# Altium schematic sheet Bawah.SchDoc
size A
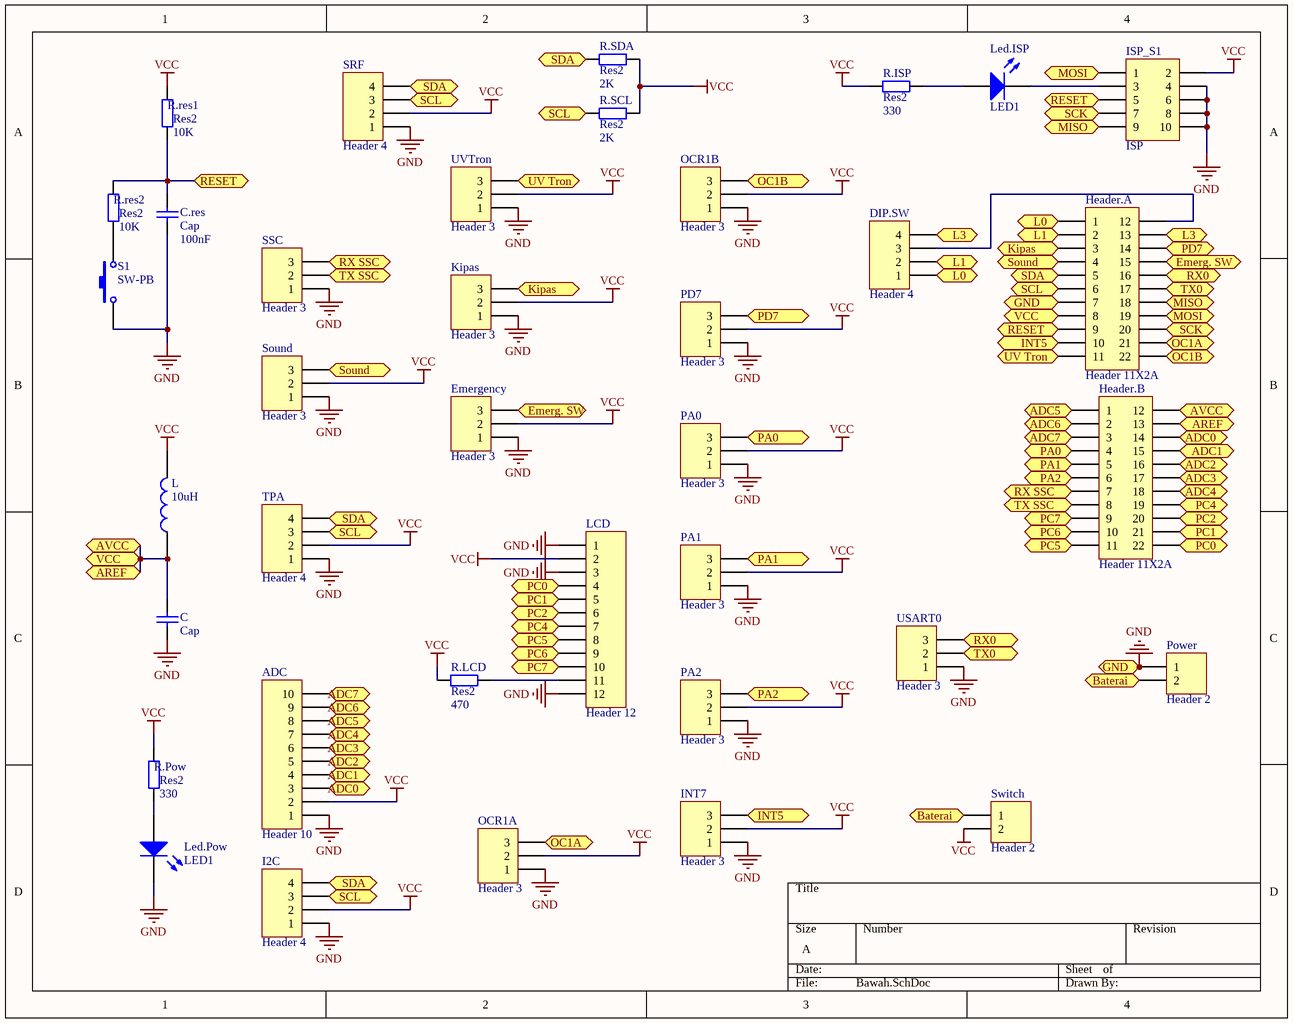
[diagram p0: Bawah.SchDoc]

## Parts
ADC  Header 10  [HDR1X10]
C  Cap  [RAD-0.3]
C.res  Cap  value 100nF  [RAD-0.3]
DIP.SW  Header 4  [HDR1X4]
Emergency  Header 3  [HDR1X3]
Header.A  Header 11X2A  [HDR2X11_CEN]
Header.B  Header 11X2A  [HDR2X11_CEN]
I2C  Header 4  [HDR1X4]
INT7  Header 3  [HDR1X3]
ISP_S1  ISP  [HDR2X5]
Kipas  Header 3  [HDR1X3]
L  10uH  [AXIAL-0.3]
LCD  Header 12  [HDR1X12]
Led.ISP  LED1  [LED-1]
Led.Pow  LED1  [LED-1]
OCR1A  Header 3  [HDR1X3]
OCR1B  Header 3  [HDR1X3]
PA0  Header 3  [HDR1X3]
PA1  Header 3  [HDR1X3]
PA2  Header 3  [HDR1X3]
PD7  Header 3  [HDR1X3]
Power  Header 2  [HDR1X2]
R.ISP  Res2  value 330  [AXIAL-0.4]
R.LCD  Res2  value 470  [AXIAL-0.4]
R.Pow  Res2  value 330  [AXIAL-0.4]
R.res1  Res2  value 10K  [AXIAL-0.4]
R.res2  Res2  value 10K  [AXIAL-0.4]
R.SCL  Res2  value 2K  [AXIAL-0.4]
R.SDA  Res2  value 2K  [AXIAL-0.4]
S1  SW-PB  [RAD-0.2]
Sound  Header 3  [HDR1X3]
SRF  Header 4  [HDR1X4]
SSC  Header 3  [HDR1X3]
Switch  Header 2  [HDR1X2]
TPA  Header 4  [HDR1X4]
USART0  Header 3  [HDR1X3]
UVTron  Header 3  [HDR1X3]

## Ports
ADC0, ADC1, ADC2, ADC3, ADC4, ADC5, ADC6, ADC7, AREF, AVCC, Baterai, Emerg. SW, GND, INT5, Kipas, L0, L1, L3, MISO, MOSI, OC1A, OC1B, PA0, PA1, PA2, PC0, PC1, PC2, PC4, PC5, PC6, PC7, PD7, RESET, RX0, RX SSC, SCK, SCL, SDA, Sound, TX0, TX SSC, UV Tron, VCC

## Nets
GND: ADC.1 C.1 C.res.1 Emergency.1 Header.A.7 I2C.1 INT7.1 ISP_S1.4 ISP_S1.6 ISP_S1.8 ISP_S1.10 Kipas.1 LCD.1 LCD.3 LCD.12 Led.Pow.2(K) OCR1A.1 OCR1B.1 PA0.1 PA1.1 PA2.1 PD7.1 Power.1 S1.1 Sound.1 SRF.1 SSC.1 TPA.1 USART0.1 UVTron.1 ; port GND
VCC: ADC.2 Emergency.2 I2C.2 INT7.2 ISP_S1.2 Kipas.2 L.2 LCD.2 OCR1A.2 OCR1B.2 PA0.2 PA1.2 PA2.2 PD7.2 R.ISP.1 R.LCD.2 R.Pow.2 R.res1.2 R.SCL.2 R.SDA.2 Sound.2 SRF.2 Switch.2 TPA.2 UVTron.2
ADC0: ADC.3 Header.B.14 ; port ADC0
ADC1: ADC.4 Header.B.15 ; port ADC1
ADC2: ADC.5 Header.B.16 ; port ADC2
ADC3: ADC.6 Header.B.17 ; port ADC3
ADC4: ADC.7 Header.B.18 ; port ADC4
ADC5: ADC.8 Header.B.1 ; port ADC5
ADC6: ADC.9 Header.B.2 ; port ADC6
ADC7: ADC.10 Header.B.3 ; port ADC7
AREF: C.2 Header.A.8 Header.B.12 Header.B.13 L.1 ; port AVCC, port AREF, port VCC
Baterai: Power.2 Switch.1 ; port Baterai
Emerg. SW: Emergency.3 Header.A.15 ; port Emerg. SW
INT5: Header.A.10 INT7.3 ; port INT5
Kipas: Header.A.3 Kipas.3 ; port Kipas
L0: DIP.SW.1 Header.A.1 ; port L0
L1: DIP.SW.2 Header.A.2 ; port L1
L3: DIP.SW.4 Header.A.13 ; port L3
MISO: Header.A.18 ISP_S1.9 ; port MISO
MOSI: Header.A.19 ISP_S1.1 ; port MOSI
OC1A: Header.A.21 OCR1A.3 ; port OC1A
OC1B: Header.A.22 OCR1B.3 ; port OC1B
PA0: Header.B.4 PA0.3 ; port PA0
PA1: Header.B.5 PA1.3 ; port PA1
PA2: Header.B.6 PA2.3 ; port PA2
PC0: Header.B.22 LCD.4 ; port PC0
PC1: Header.B.21 LCD.5 ; port PC1
PC2: Header.B.20 LCD.6 ; port PC2
PC4: Header.B.19 LCD.7 ; port PC4
PC5: Header.B.11 LCD.8 ; port PC5
PC6: Header.B.10 LCD.9 ; port PC6
PC7: Header.B.9 LCD.10 ; port PC7
PD7: Header.A.14 PD7.3 ; port PD7
RESET: C.res.2 Header.A.9 ISP_S1.5 R.res1.1 R.res2.2 ; port RESET
RX0: Header.A.16 USART0.3 ; port RX0
RX SSC: Header.B.7 SSC.3 ; port RX SSC
SCK: Header.A.20 ISP_S1.7 ; port SCK
SCL: Header.A.6 I2C.3 R.SCL.1 SRF.3 TPA.3 ; port SCL
SDA: Header.A.5 I2C.4 R.SDA.1 SRF.4 TPA.4 ; port SDA
Sound: Header.A.4 Sound.3 ; port Sound
TX0: Header.A.17 USART0.2 ; port TX0
TX SSC: Header.B.8 SSC.2 ; port TX SSC
UV Tron: Header.A.11 UVTron.3 ; port UV Tron
NetDIP.SW_3: DIP.SW.3 Header.A.12
NetISP_S1_3: ISP_S1.3 Led.ISP.2(K)
NetLCD_11: LCD.11 R.LCD.1
NetLed.ISP_1: Led.ISP.1(A) R.ISP.2
NetLed.Pow_1: Led.Pow.1(A) R.Pow.1
NetR.res2_1: R.res2.1 S1.2

## Library data of the parts
ADC = Header 10: Header, 10-Pin; LatestRevisionDate: 17-Jul-2002; LatestRevisionNote: Re-released for DXP Platform.; Publisher: Altium Limited
C C.res = Cap: Capacitor; Published: 8-Jun-2000; LatestRevisionDate: 17-Jul-2002; LatestRevisionNote: Re-released for DXP Platform.; PackageReference: RAD-0.3; Publisher: Altium Limited
DIP.SW I2C SRF TPA = Header 4: Header, 4-Pin; LatestRevisionDate: 17-Jul-2002; LatestRevisionNote: Re-released for DXP Platform.; Publisher: Altium Limited
Emergency INT7 Kipas OCR1A OCR1B PA0-PA2 PD7 Sound SSC USART0 UVTron = Header 3: Header, 3-Pin; LatestRevisionDate: 17-Jul-2002; LatestRevisionNote: Re-released for DXP Platform.; Publisher: Altium Limited
Header.A Header.B = Header 11X2A: Header, 11-Pin, Dual row; LatestRevisionDate: 17-Jul-2002; LatestRevisionNote: Re-released for DXP Platform.; Publisher: Altium Limited
ISP_S1 = Header 5X2: Header, 5-Pin, Dual row; LatestRevisionDate: 17-Jul-2002; LatestRevisionNote: Re-released for DXP Platform.; Publisher: Altium Limited
L = INDUCTOR
LCD = Header 12: Header, 12-Pin; LatestRevisionDate: 17-Jul-2002; LatestRevisionNote: Re-released for DXP Platform.; Publisher: Altium Limited
Led.ISP Led.Pow = LED1: Typical RED GaAs LED; Published: 8-Jun-2000; LatestRevisionDate: 08-Jul-2005; LatestRevisionNote: Mech Layer 1 removed.; PackageReference: LED-1; Publisher: Altium Limited
Power Switch = Header 2: Header, 2-Pin; LatestRevisionDate: 17-Jul-2002; LatestRevisionNote: Re-released for DXP Platform.; Publisher: Altium Limited
R.ISP R.LCD R.Pow R.res1 R.res2 R.SCL R.SDA = Res2: Resistor; Published: 8-Jun-2000; LatestRevisionDate: 17-Jul-2002; LatestRevisionNote: Re-released for DXP Platform.; PackageReference: AXIAL-0.4; Publisher: Altium Limited
S1 = SW-PB: Switch; Published: 24-Mar-1999; LatestRevisionDate: 17-Jul-2002; LatestRevisionNote: Re-released for DXP Platform.; PackageReference: SPST-2; Publisher: Altium Limited